# Altium project LC125.PrjPcb
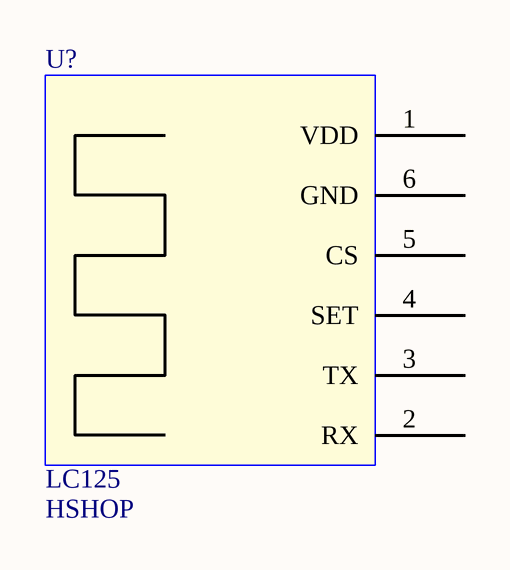
[diagram p0: lc125.SchDoc]
1 sheet, 1 parts. Net scope: global (net labels, ports and power ports of the same name join across sheets).
Board file: lc125b.PcbDoc

## Sheet lc125.SchDoc
size A

### Parts
U?  LC125  Local supplier: HSHOP

### Nets

Not connected (* = marked no-connect by the designer): U? 1(VDD) 2(RX) 3(TX) 4(SET) 5(CS) 6(GND)

### Library data of the parts
U? = LC12S: ComponentLink1Description: LC125; ComponentLink1URL: https://hshop.vn/products/mach-thu-phat-rf-uart-lc12s-2-4ghz?fbclid=IwAR1NIYiWxxjqyQFQS5YmZ54eD_X7SrnuPScnG1CYn17biH2eOLaeQwyqNpg; Local supplier: https://hshop.vn/products/mach-thu-phat-rf-uart-lc12s-2-4ghz?fbclid=IwAR1NIYiWxxjqyQFQS5YmZ54eD_X7SrnuPScnG1CYn17biH2eOLaeQwyqNpg; Local supplier part number: HS000895; Supplier 1: Digi-Key; Supplier Part Number 1: SAM9976-ND